# Altium schematic sheet 2- balenaFin HAT SCH.SchDoc: HAT Template Schematic
size A
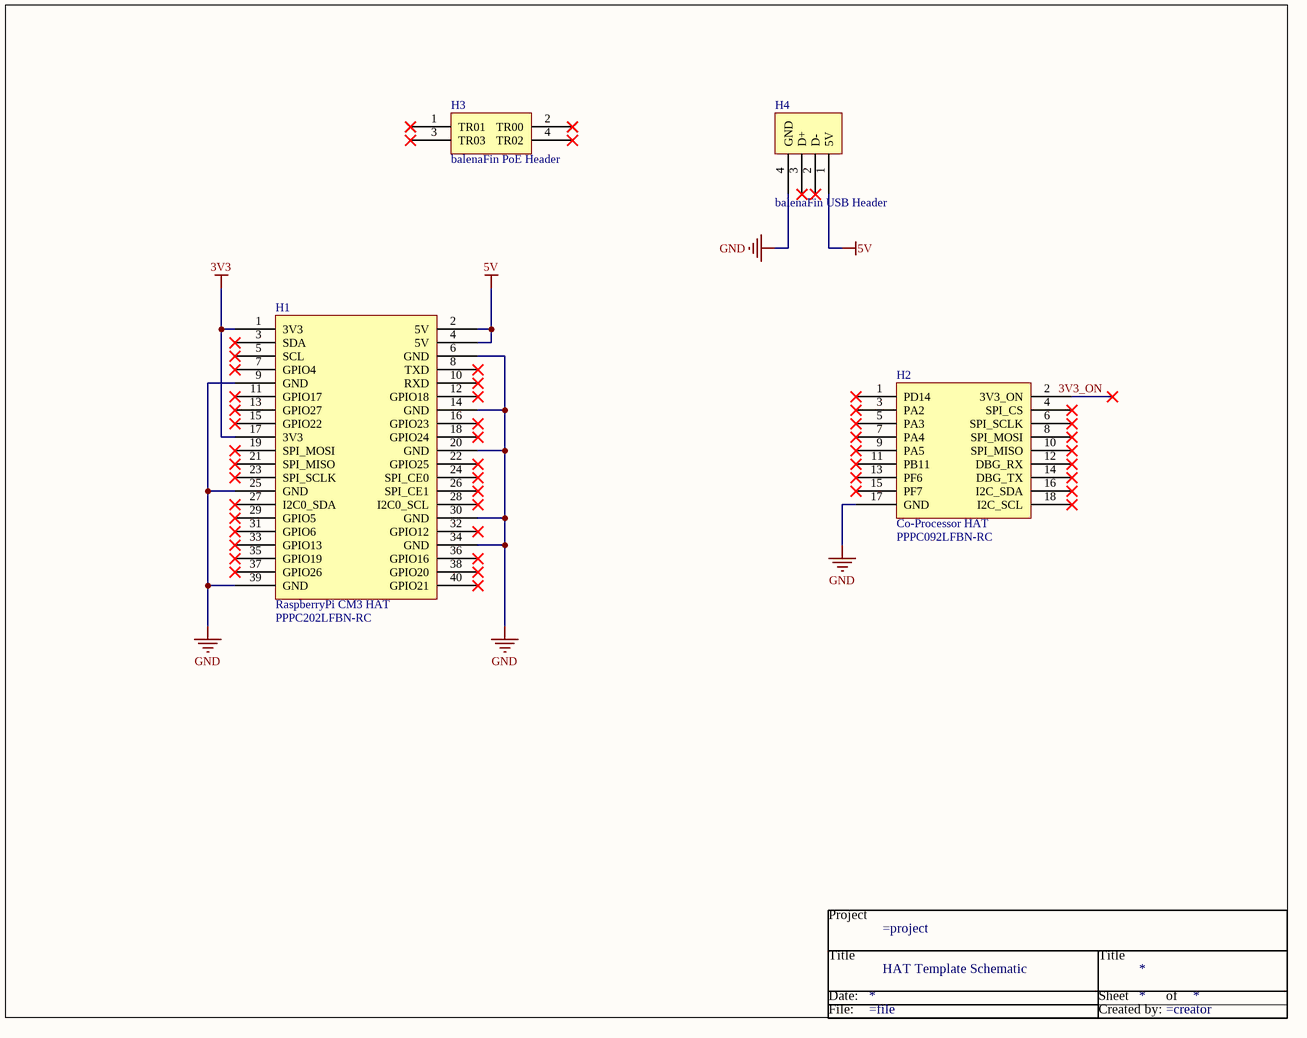
[diagram p0: 2- balenaFin HAT SCH.SchDoc]

## Parts
*  Title_Block  (value not drawn)  (graphical)
H1  RaspberryPi CM3 HAT  Supplier Part Number 1: PPPC202LFBN-RC  [HDR2x20_2mm54]
H2  Co-Processor HAT  Manufacturer Part Number: PPPC092LFBN-RC  [HDR2x9_2mm54]
H3  balenaFin PoE Header  [HDR2x2_2mm54]
H4  balenaFin USB Header  [HDR1x4_2mm54]

## Nets
3V3: H1.1(3V3) H1.17(3V3)
5V: H1.2(5V) H1.4(5V) H4.1(5V)
GND: H1.6(GND) H1.9(GND) H1.14(GND) H1.20(GND) H1.25(GND) H1.30(GND) H1.34(GND) H1.39(GND) H2.17(GND) H4.4(GND)

Not connected (* = marked no-connect by the designer): H1 3(SDA)* 5(SCL)* 7(GPIO4)* 8(TXD)* 10(RXD)* 11(GPIO17)* 12(GPIO18)* 13(GPIO27)* 15(GPIO22)* 16(GPIO23)* 18(GPIO24)* 19(SPI_MOSI)* 21(SPI_MISO)* 22(GPIO25)* 23(SPI_SCLK)* 24(SPI_CE0)* 26(SPI_CE1)* 27(I2C0_SDA)* 28(I2C0_SCL)* 29(GPIO5)* 31(GPIO6)* 32(GPIO12)* 33(GPIO13)* 35(GPIO19)* 36(GPIO16)* 37(GPIO26)* 38(GPIO20)* 40(GPIO21)*; H2 1(PD14)* 2(3V3_ON)* 3(PA2)* 4(SPI_CS)* 5(PA3)* 6(SPI_SCLK)* 7(PA4)* 8(SPI_MOSI)* 9(PA5)* 10(SPI_MISO)* 11(PB11)* 12(DBG_RX)* 13(PF6)* 14(DBG_TX)* 15(PF7)* 16(I2C_SDA)* 18(I2C_SCL)*; H3 1(TR01)* 2(TR00)* 3(TR03)* 4(TR02)*; H4 2(D-)* 3(D+)*

## Notes on the sheet
- Labels drawn without touching a wire or pin: 3V3_ON
- (in symbol Title_Block) Project; Title; Date:; Sheet; of; File:; Created by:

## Library data of the parts
H1 = CM3_Header: Raspberry Pi CM3 HAT Socket; Manufacturer: Sullins; Number of Positions: 40; Connector Type: Header,Socket; Pitch: 0.1inch; Supplier 1: Future Electronics; Manufacturer Part Number: PPPC202LFBN-RC; Stock 1: 0; Mount: Through Hole; Color: Black; Contact Plating: Gold; Contact Material: Bronze; Housing Material: Plastic; Package Quantity: 1000; Number of Rows: 2; Packaging: Bulk; Termination: Solder; Length: 51.3mm; Height: 8.5mm; Row Spacing: 0.1inch; Width: 5mm; Lead Free: Lead Free
H2 = COP_Header: balenaFin Co-Processor HAT Socket; Manufacturer: Sullins; Number of Positions: 18; Connector Type: Header,Socket; Pitch: 0.1inch; Supplier 1: Future Electronics; Stock 1: 0; Mount: Through Hole; Color: Black; Contact Plating: Gold; Contact Material: Bronze; Housing Material: Plastic; Package Quantity: 1000; Number of Rows: 2; Packaging: Bulk; Termination: Solder; Length: 23.4mm; Height: 8.5mm; Row Spacing: 0.1inch; Width: 5mm; Lead Free: Lead Free; Supplier Part Number 1: PPPC092LFBN-RC
H3 = POE_Header: Manufacturer: Sullins; Manufacturer Part Number: PPPC022LFBN-RC; Number of Positions: 4; Connector Type: Header,Socket; Pitch: 0.1inch; Supplier 1: Future Electronics; Stock 1: 0; Mount: Through Hole; Color: Black; Contact Plating: Gold; Contact Material: Bronze; Housing Material: Plastic; Package Quantity: 1000; Number of Rows: 2; Packaging: Bulk; Termination: Solder; Length: 5.58mm; Height: 8.5mm; Row Spacing: 0.1inch; Width: 5mm; Lead Free: Lead Free; Supplier Part Number 1: PPPC022LFBN-RC
H4 = USB_Header: Manufacturer: Sullins; Manufacturer Part Number: PPPC041LFBN-RC; Number of Positions: 4; Connector Type: Header,Socket; Pitch: 0.1inch; Supplier 1: Future Electronics; Stock 1: 0; Mount: Through Hole; Color: Black; Contact Plating: Gold; Contact Material: Bronze; Housing Material: Plastic; Package Quantity: 1000; Number of Rows: 1; Packaging: Bulk; Termination: Solder; Length: 10.7mm; Height: 8.5mm; Width: 2.5mm; Lead Free: Lead Free; Supplier Part Number 1: 6009019